# EAGLE schematic PPR_servo (EAGLE 6.5.0)

## Sheet 1 of 6
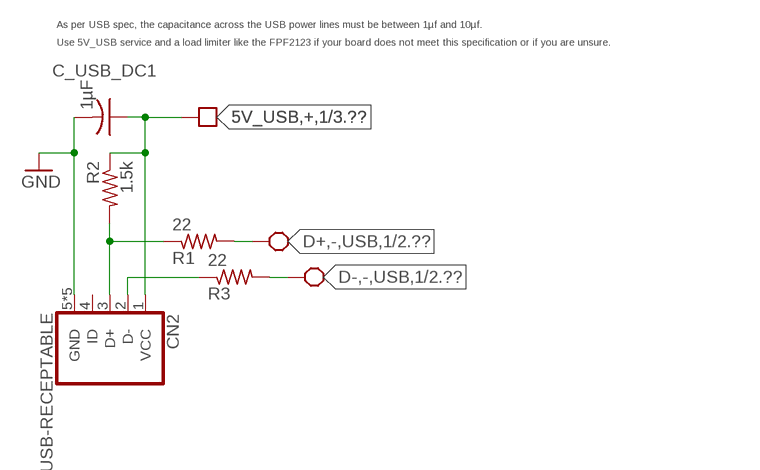
[diagram p0: schematic, sheet 1]

### Parts
C_USB_DC1  1µF  C-USC0603  [C0603]
CN2  USB-RECEPTABLE  [FCI-10103594-0001LF]
R1  22  R-US_R0603  [R0603]
R2  1.5k  R-US_R0603  [R0603]
R3  22  R-US_R0603  [R0603]

### Nets
5V_USB,+,1: C_USB_DC1.1 CN2.1(VCC) R2.1 ; supply symbol labelled BLOCK_OPTIONAL ; also sheet 3,5,6
D+,-,USB,1: R1.2 ; supply symbol labelled BLOCK_REQUIREMENT ; also sheet 2
D+_IN_1: CN2.3(D+) R1.1 R2.2
D-,-,USB,1: R3.2 ; supply symbol labelled BLOCK_REQUIREMENT ; also sheet 2
D-_IN_1: CN2.2(D-) R3.1
GND: C_USB_DC1.2 CN2.5(GND) CN2.P$1(GND) CN2.P$2(GND) CN2.P$3(GND) CN2.P$4(GND) ; also sheet 2,3,4,5,6
Unconnected: CN2.4(ID)

### Notes on the sheet
- As per USB spec, the capacitance across the USB power lines must be between 1µf and 10µf.
- Use 5V_USB service and a load limiter like the FPF2123 if your board does not meet this specification or if you are unsure.

## Sheet 2 of 6
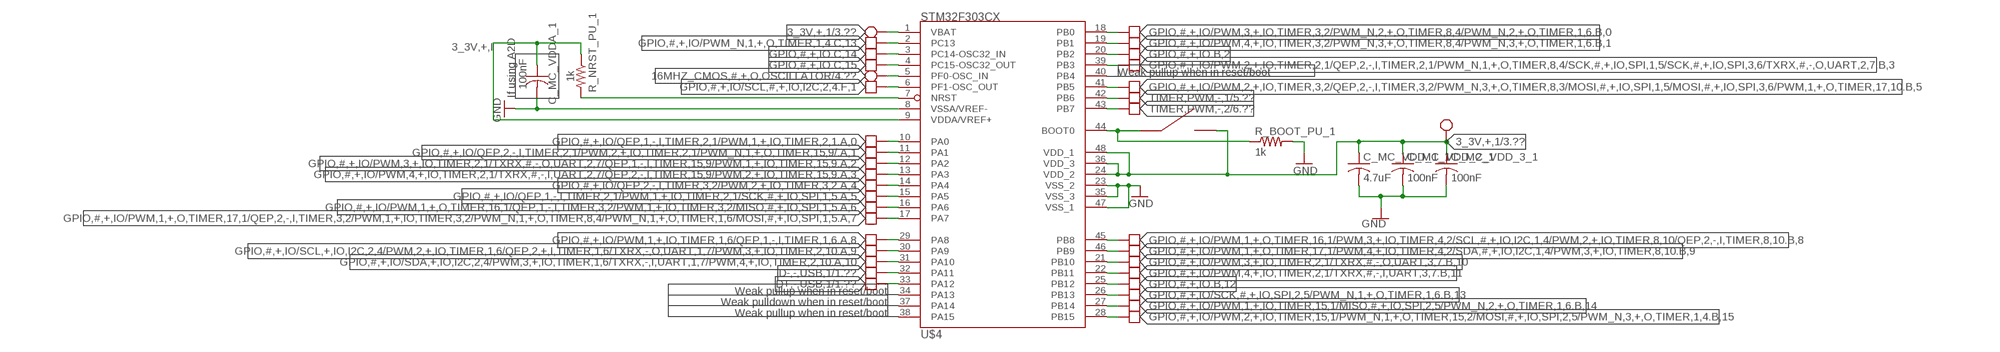
[diagram p1: schematic, sheet 2]

### Parts
C_MC_VDD_1_1  4.7uF  C-USC0603  [C0603]
C_MC_VDD_2_1  100nF  C-USC0603  [C0603]
C_MC_VDD_3_1  100nF  C-USC0603  [C0603]
C_MC_VDDA_1  100nF  C-USC0603  [C0603]
R_BOOT_PU_1  1k  R-US_R0603  [R0603]
R_NRST_PU_1  1k  R-US_R0603  [R0603]
SW1  B3U  [B3U]
U$4  STM32F303CX  [LQFP48]

### Nets
3_3V,+,1: C_MC_VDD_1_1.1 C_MC_VDD_2_1.1 C_MC_VDD_3_1.1 SW1.P$2 U$4.1(VBAT) U$4.24(VDD_2) U$4.36(VDD_3) U$4.48(VDD_1) ; supply symbol labelled BLOCK_REQUIREMENT ; also sheet 3,4
3_3V,+,I: C_MC_VDDA_1.1 R_NRST_PU_1.1 U$4.9(VDDA/VREF+)
16MHZ_CMOS,#,+,O,OSCILLATOR: U$4.5(PF0-OSC_IN) ; supply symbol labelled BLOCK_REQUIREMENT ; also sheet 4
BOOT0_1: R_BOOT_PU_1.1 SW1.P$1 U$4.44(BOOT0)
D+,-,USB,1: U$4.33(PA12) ; supply symbol labelled BLOCK_OPTIONAL ; also sheet 1
D-,-,USB,1: U$4.32(PA11) ; supply symbol labelled BLOCK_OPTIONAL ; also sheet 1
GND: C_MC_VDD_1_1.2 C_MC_VDD_2_1.2 C_MC_VDD_3_1.2 C_MC_VDDA_1.2 R_BOOT_PU_1.2 U$4.8(VSSA/VREF-) U$4.23(VSS_2) U$4.35(VSS_3) U$4.47(VSS_1) ; also sheet 1,3,4,5,6
GPIO,#,+,IO.B,2: U$4.20(PB2) ; supply symbol labelled BLOCK_OPTIONAL
GPIO,#,+,IO.B,12: U$4.25(PB12) ; supply symbol labelled BLOCK_OPTIONAL
GPIO,#,+,IO.C,14: U$4.3(PC14-OSC32_IN) ; supply symbol labelled BLOCK_OPTIONAL
GPIO,#,+,IO.C,15: U$4.4(PC15-OSC32_OUT) ; supply symbol labelled BLOCK_OPTIONAL
GPIO,#,+,IO/PWM,1,+,IO,TIMER,1,6/QEP,1,-,I,TIMER,1,6.A,8: U$4.29(PA8) ; supply symbol labelled BLOCK_OPTIONAL
GPIO,#,+,IO/PWM,1,+,IO,TIMER,15,1/MISO,#,+,IO,SPI,2,5/PWM_N,2,+,O,TIMER,1,6.B,14: U$4.27(PB14) ; supply symbol labelled BLOCK_OPTIONAL
GPIO,#,+,IO/PWM,1,+,O,TIMER,16,1/PWM,3,+,IO,TIMER,4,2/SCL,#,+,IO,I2C,1,4/PWM,2,+,IO,TIMER,8,10/QEP,2,-,I,TIMER,8,10.B,8: U$4.45(PB8) ; supply symbol labelled BLOCK_OPTIONAL
GPIO,#,+,IO/PWM,1,+,O,TIMER,16,1/QEP,1,-,I,TIMER,3,2/PWM,1,+,IO,TIMER,3,2/MISO,#,+,IO,SPI,1,5.A,6: U$4.16(PA6) ; supply symbol labelled BLOCK_OPTIONAL
GPIO,#,+,IO/PWM,1,+,O,TIMER,17,1/PWM,4,+,IO,TIMER,4,2/SDA,#,+,IO,I2C,1,4/PWM,3,+,IO,TIMER,8,10.B,9: U$4.46(PB9) ; supply symbol labelled BLOCK_OPTIONAL
GPIO,#,+,IO/PWM,1,+,O,TIMER,17,1/QEP,2,-,I,TIMER,3,2/PWM,1,+,IO,TIMER,3,2/PWM_N,1,+,O,TIMER,8,4/PWM_N,1,+,O,TIMER,1,6/MOSI,#,+,IO,SPI,1,5.A,7: U$4.17(PA7) ; supply symbol labelled BLOCK_OPTIONAL
GPIO,#,+,IO/PWM,2,+,IO,TIMER,2,1/QEP,2,-,I,TIMER,2,1/PWM_N,1,+,O,TIMER,8,4/SCK,#,+,IO,SPI,1,5/SCK,#,+,IO,SPI,3,6/TXRX,#,-,O,UART,2,7.B,3: U$4.39(PB3) ; supply symbol labelled BLOCK_OPTIONAL
GPIO,#,+,IO/PWM,2,+,IO,TIMER,3,2/QEP,2,-,I,TIMER,3,2/PWM_N,3,+,O,TIMER,8,3/MOSI,#,+,IO,SPI,1,5/MOSI,#,+,IO,SPI,3,6/PWM,1,+,O,TIMER,17,10.B,5: U$4.41(PB5) ; supply symbol labelled BLOCK_OPTIONAL
GPIO,#,+,IO/PWM,2,+,IO,TIMER,15,1/PWM_N,1,+,O,TIMER,15,2/MOSI,#,+,IO,SPI,2,5/PWM_N,3,+,O,TIMER,1,4.B,15: U$4.28(PB15) ; supply symbol labelled BLOCK_OPTIONAL
GPIO,#,+,IO/PWM,3,+,IO,TIMER,2,1/TXRX,#,-,O,UART,2,7/QEP,1,-,I,TIMER,15,9/PWM,1,+,IO,TIMER,15,9.A,2: U$4.12(PA2) ; supply symbol labelled BLOCK_OPTIONAL
GPIO,#,+,IO/PWM,3,+,IO,TIMER,2,1/TXRX,#,-,O,UART,3,7.B,10: U$4.21(PB10) ; supply symbol labelled BLOCK_OPTIONAL
GPIO,#,+,IO/PWM,3,+,IO,TIMER,3,2/PWM_N,2,+,O,TIMER,8,4/PWM_N,2,+,O,TIMER,1,6.B,0: U$4.18(PB0) ; supply symbol labelled BLOCK_OPTIONAL
GPIO,#,+,IO/PWM,4,+,IO,TIMER,2,1/TXRX,#,-,I,UART,2,7/QEP,2,-,I,TIMER,15,9/PWM,2,+,IO,TIMER,15,9.A,3: U$4.13(PA3) ; supply symbol labelled BLOCK_OPTIONAL
GPIO,#,+,IO/PWM,4,+,IO,TIMER,2,1/TXRX,#,-,I,UART,3,7.B,11: U$4.22(PB11) ; supply symbol labelled BLOCK_OPTIONAL
GPIO,#,+,IO/PWM,4,+,IO,TIMER,3,2/PWM_N,3,+,O,TIMER,8,4/PWM_N,3,+,O,TIMER,1,6.B,1: U$4.19(PB1) ; supply symbol labelled BLOCK_OPTIONAL
GPIO,#,+,IO/PWM_N,1,+,O,TIMER,1,4.C,13: U$4.2(PC13) ; supply symbol labelled BLOCK_OPTIONAL
GPIO,#,+,IO/QEP,1,-,I,TIMER,2,1/PWM,1,+,IO,TIMER,2,1.A,0: U$4.10(PA0) ; supply symbol labelled BLOCK_OPTIONAL
GPIO,#,+,IO/QEP,1,-,I,TIMER,2,1/PWM,1,+,IO,TIMER,2,1/SCK,#,+,IO,SPI,1,5.A,5: U$4.15(PA5) ; supply symbol labelled BLOCK_OPTIONAL
GPIO,#,+,IO/QEP,2,-,I,TIMER,2,1/PWM,2,+,IO,TIMER,2,1/PWM_N,1,+,O,TIMER,15,9/.A,1: U$4.11(PA1) ; supply symbol labelled BLOCK_OPTIONAL
GPIO,#,+,IO/QEP,2,-,I,TIMER,3,2/PWM,2,+,IO,TIMER,3,2.A,4: U$4.14(PA4) ; supply symbol labelled BLOCK_OPTIONAL
GPIO,#,+,IO/SCK,#,+,IO,SPI,2,5/PWM_N,1,+,O,TIMER,1,6.B,13: U$4.26(PB13) ; supply symbol labelled BLOCK_OPTIONAL
GPIO,#,+,IO/SCL,#,+,IO,I2C,2,4.F,1: U$4.6(PF1-OSC_OUT) ; supply symbol labelled BLOCK_OPTIONAL
GPIO,#,+,IO/SCL,+,IO,I2C,2,4/PWM,2,+,IO,TIMER,1,6/QEP,2,+,I,TIMER,1,6/TXRX,-,O,UART,1,7/PWM,3,+,IO,TIMER,2,10.A,9: U$4.30(PA9) ; supply symbol labelled BLOCK_OPTIONAL
GPIO,#,+,IO/SDA,+,IO,I2C,2,4/PWM,3,+,IO,TIMER,1,6/TXRX,-,I,UART,1,7/PWM,4,+,IO,TIMER,2,10.A,10: U$4.31(PA10) ; supply symbol labelled BLOCK_OPTIONAL
NRST_1: R_NRST_PU_1.2 U$4.7(NRST)
TIMER,PWM,-,1: U$4.42(PB6) ; supply symbol labelled BLOCK_OPTIONAL ; also sheet 5
TIMER,PWM,-,2: U$4.43(PB7) ; supply symbol labelled BLOCK_OPTIONAL ; also sheet 6
Unconnected: U$4.34(PA13) U$4.37(PA14) U$4.38(PA15) U$4.40(PB4)

### Notes on the sheet
- Weak pullup when in reset/boot
- If using A2D
- Weak pullup when in reset/boot
- Weak pulldown when in reset/boot
- Weak pullup when in reset/boot

## Sheet 3 of 6
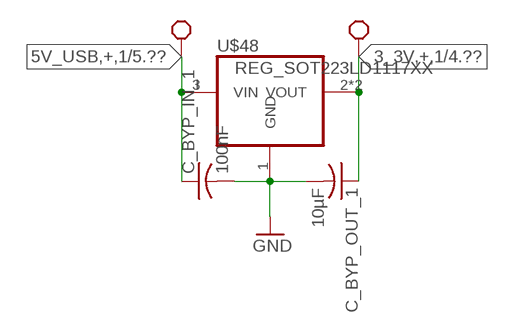
[diagram p2: schematic, sheet 3]

### Parts
C_BYP_IN_1  100nF  C-USC1206  [C1206]
C_BYP_OUT_1  10µF  C-USC0603  [C0603]
U$48  REG_SOT223LD1117XX  [SOT-223]

### Nets
3_3V,+,1: C_BYP_OUT_1.1 U$48.2(VOUT) U$48.4(VOUT) ; supply symbol labelled BLOCK_REQUIREMENT ; also sheet 2,4
5V_USB,+,1: C_BYP_IN_1.1 U$48.3(VIN) ; supply symbol labelled BLOCK_REQUIREMENT ; also sheet 1,5,6
GND: C_BYP_IN_1.2 C_BYP_OUT_1.2 U$48.1(GND) ; also sheet 1,2,4,5,6

## Sheet 4 of 6
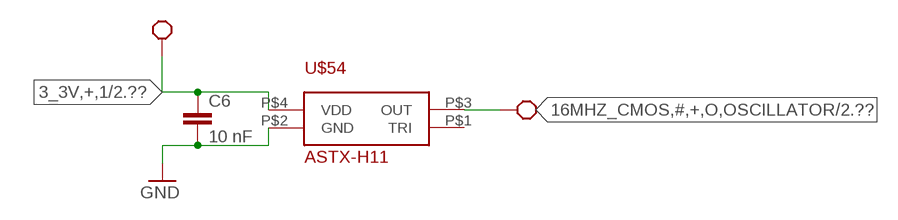
[diagram p3: schematic, sheet 4]

### Parts
C6  10 nF  C-EUC0402  [C0402]
U$54  ASTX-H11  [ASTX-H11]

### Nets
3_3V,+,1: C6.1 U$54.P$4(VDD) ; supply symbol labelled BLOCK_REQUIREMENT ; also sheet 2,3
16MHZ_CMOS,#,+,O,OSCILLATOR: U$54.P$3(OUT) ; supply symbol labelled BLOCK_REQUIREMENT ; also sheet 2
GND: C6.2 U$54.P$2(GND) ; also sheet 1,2,3,5,6
Unconnected: U$54.P$1(TRI)

## Sheet 5 of 6
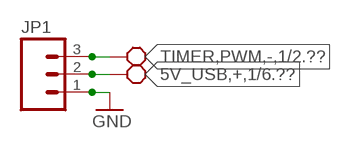
[diagram p4: schematic, sheet 5]

### Parts
JP1  M03LONGPADS  [1X03_LONGPADS]

### Nets
5V_USB,+,1: JP1.2 ; supply symbol labelled BLOCK_REQUIREMENT ; also sheet 1,3,6
GND: JP1.1 ; also sheet 1,2,3,4,6
TIMER,PWM,-,1: JP1.3 ; supply symbol labelled BLOCK_REQUIREMENT ; also sheet 2

## Sheet 6 of 6
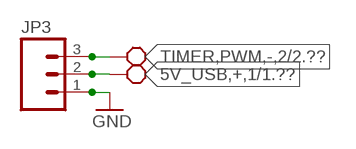
[diagram p5: schematic, sheet 6]

### Parts
JP3  M03LONGPADS  [1X03_LONGPADS]

### Nets
5V_USB,+,1: JP3.2 ; supply symbol labelled BLOCK_REQUIREMENT ; also sheet 1,3,5
GND: JP3.1 ; also sheet 1,2,3,4,5
TIMER,PWM,-,2: JP3.3 ; supply symbol labelled BLOCK_REQUIREMENT ; also sheet 2

## Library data of the parts
C6 = rcl:C-EU: CAPACITOR, European symbol
C_BYP_IN_1 C_BYP_OUT_1 C_MC_VDD_1_1 C_MC_VDD_2_1 C_MC_VDD_3_1 C_MC_VDDA_1 C_USB_DC1 = resistor:C-US: CAPACITOR, American symbol
CN2 = neels:USB-RECEPTABLE: USB Receptable
JP1 JP3 = SparkFun:M03: Header 3 Standard 3-pin 0.1" header. Use with straight break away headers (SKU : PRT-00116), right angle break away headers (PRT-00553), swiss pins (PRT-00743), machine pins (PRT-00117), and female headers (PRT-00115). Molex polarized connector foot print use with SKU : PRT-08232 with associated crimp pins and housings.
R1-R3 R_BOOT_PU_1 R_NRST_PU_1 = resistor:R-US_: RESISTOR, American symbol
SW1 = zz-upenn:B3U
U$4 = piccoli:STM32F303CX
U$48 = piccoli:REG_SOT223
U$54 = block_parts:ASTX-H11

## Net classes
0 default: width 0.178 mm, drill 0.381 mm, clearance 0.178 mm